# EAGLE design Work Height Sensor Base_v1p1 (EAGLE 9.3.1)
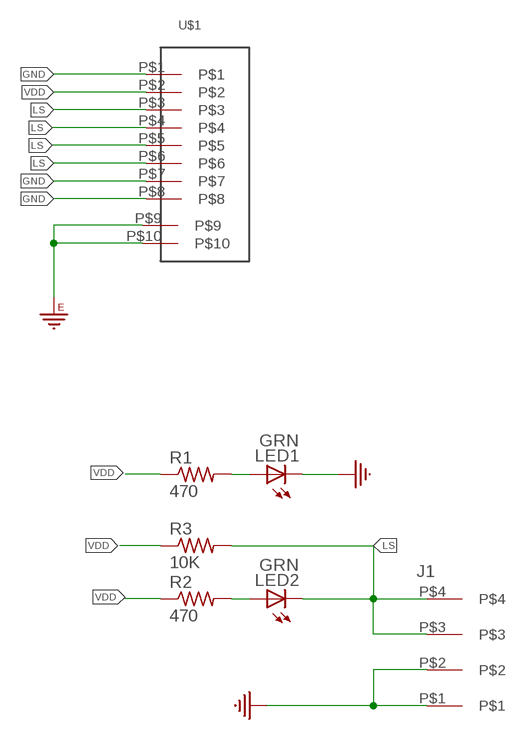
[diagram p0: schematic, sheet 1]

## Parts
J1  3.81MM_1_X_4_RT_ANGLE_PLUG_HEADER  [1X4_3.81MM_PITCH]
LED1  LED_0805_GREEN  [LED_0805_GREEN]
LED2  LED_0805_GREEN  [LED_0805_GREEN]
R1  470  R_0402  [0402]
R2  470  R_0402  [0402]
R3  10K  R_0402  [0402]
U$1  RJ45_SMTRJ  [RJ45_SMT]

## Nets
GND: J1.P$1 J1.P$2 LED1.C U$1.P$1 U$1.P$7 U$1.P$8
GNDE: U$1.P$9 U$1.P$10
LS: J1.P$3 J1.P$4 LED2.C R3.P$2 U$1.P$3 U$1.P$4 U$1.P$5 U$1.P$6
N$1: LED2.A R2.P$2
N$3: LED1.A R1.P$2
VDD: R1.P$1 R2.P$1 R3.P$1 U$1.P$2

## Library data of the parts
J1 = 3D_MIG_Controller:3.81MM_1_X_4_RT_ANGLE_PLUG_HEADER
LED1 LED2 = 3D_MIG_Controller:LED_0805_GREEN
R1-R3 = 3D_MIG_Controller:R_0402
U$1 = 3D_MIG_Controller:RJ45_SMT

## Board
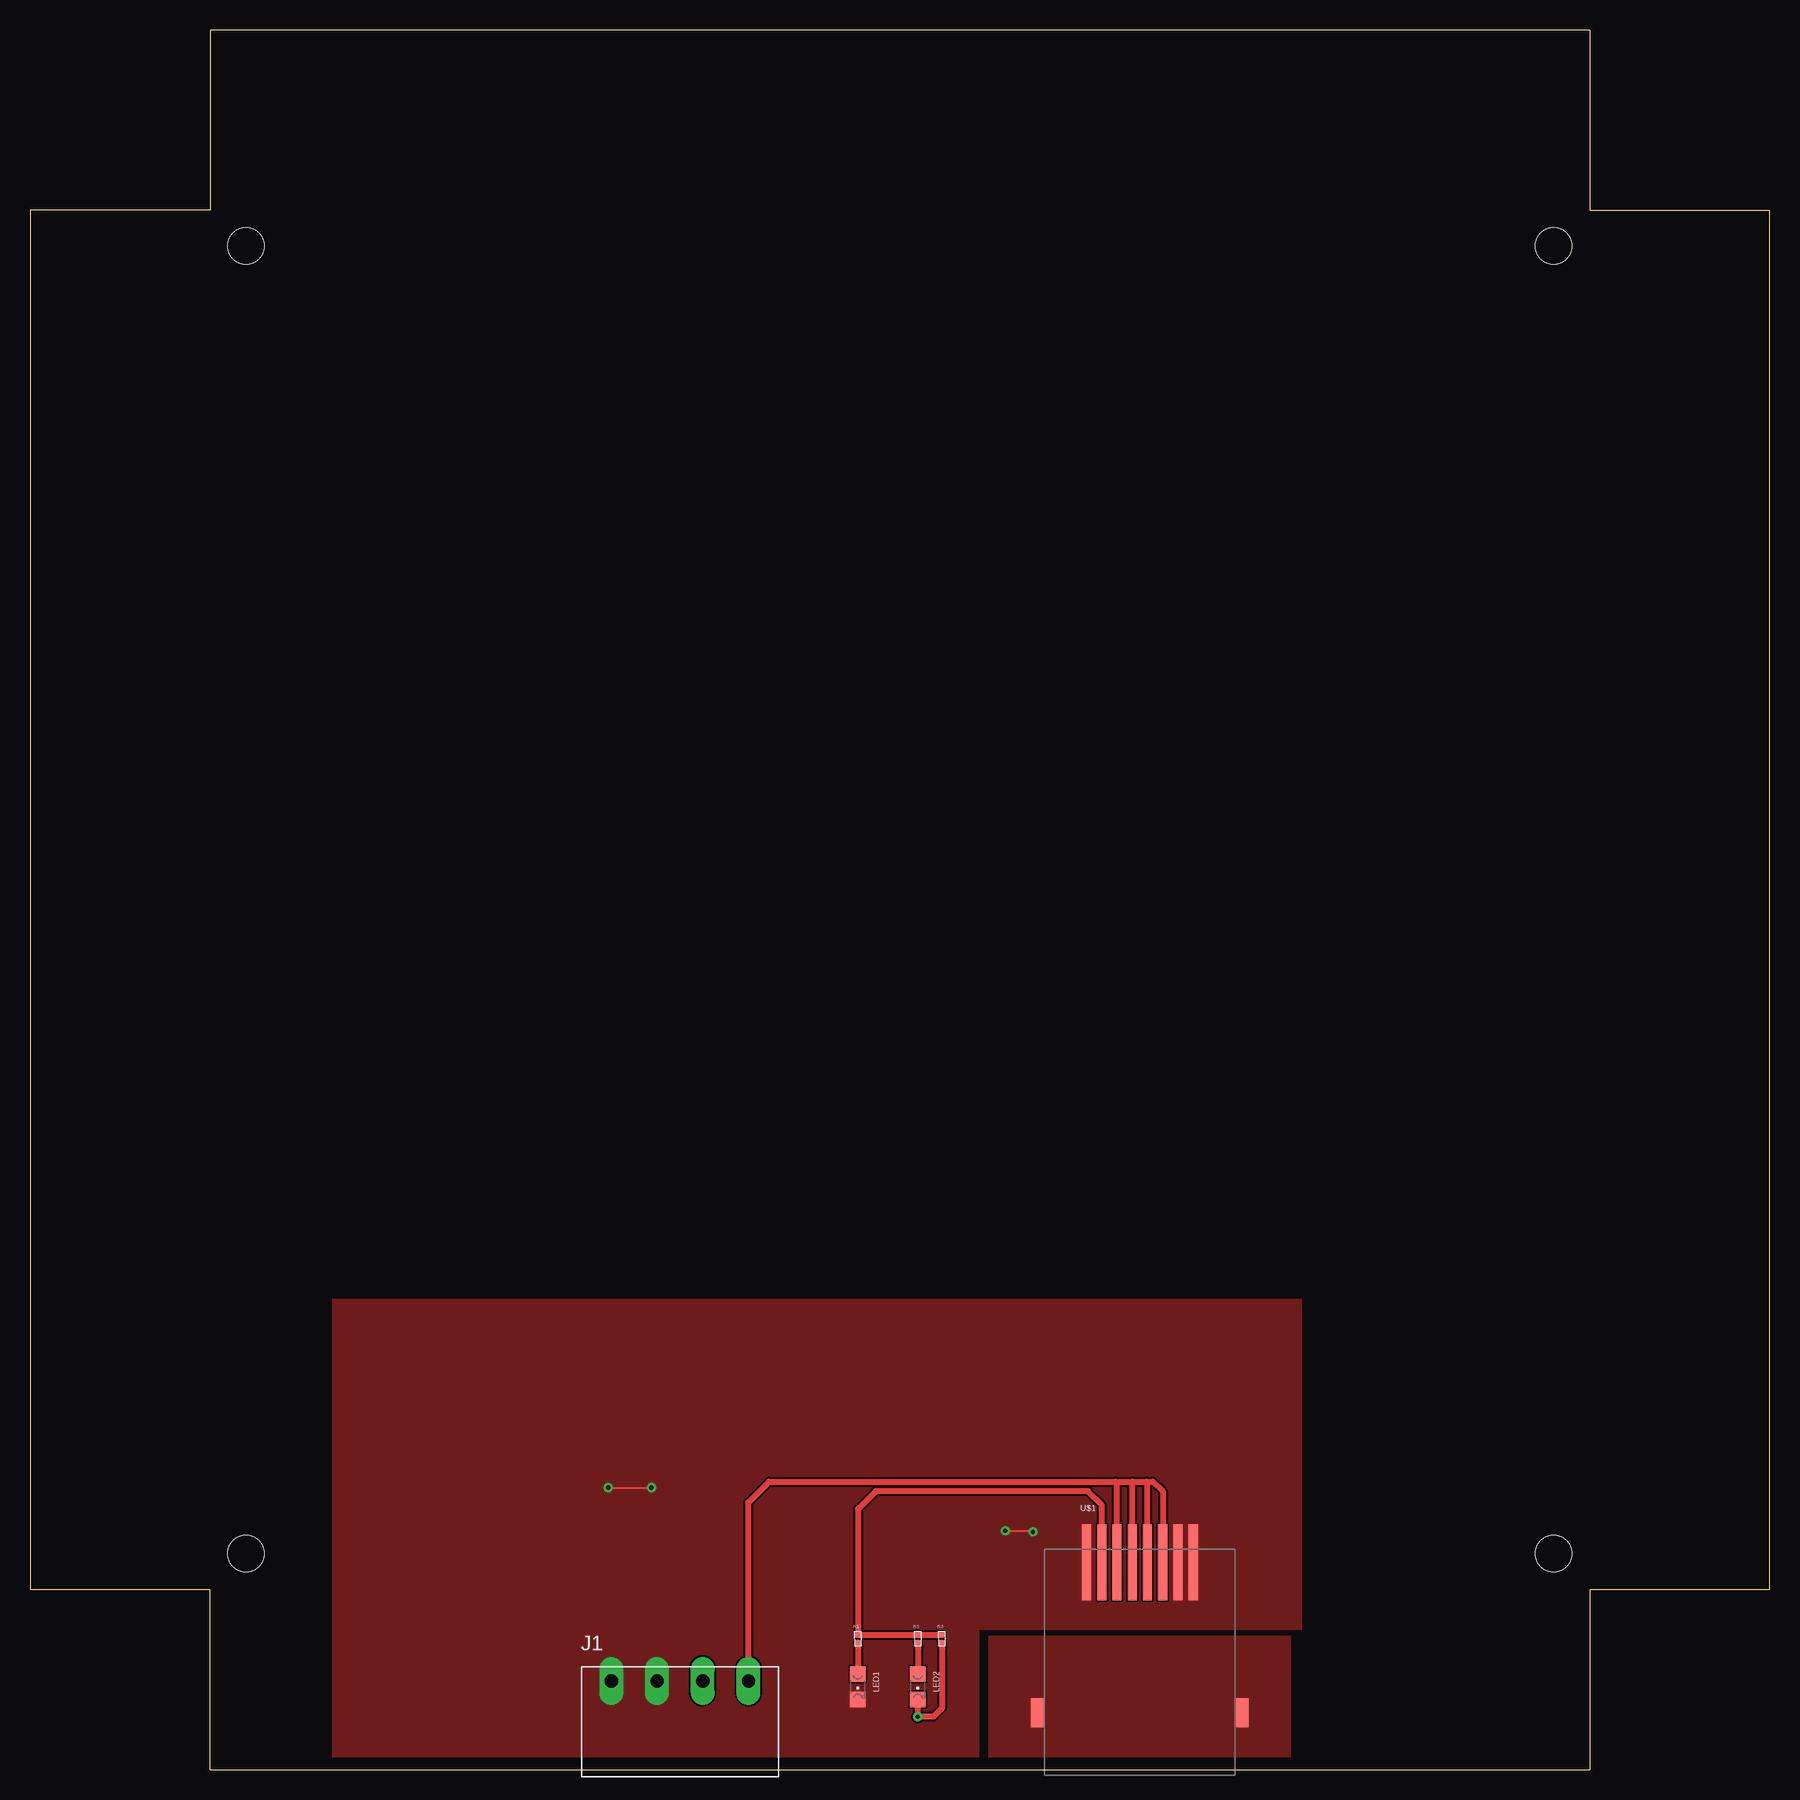
[diagram p1: board, top side]
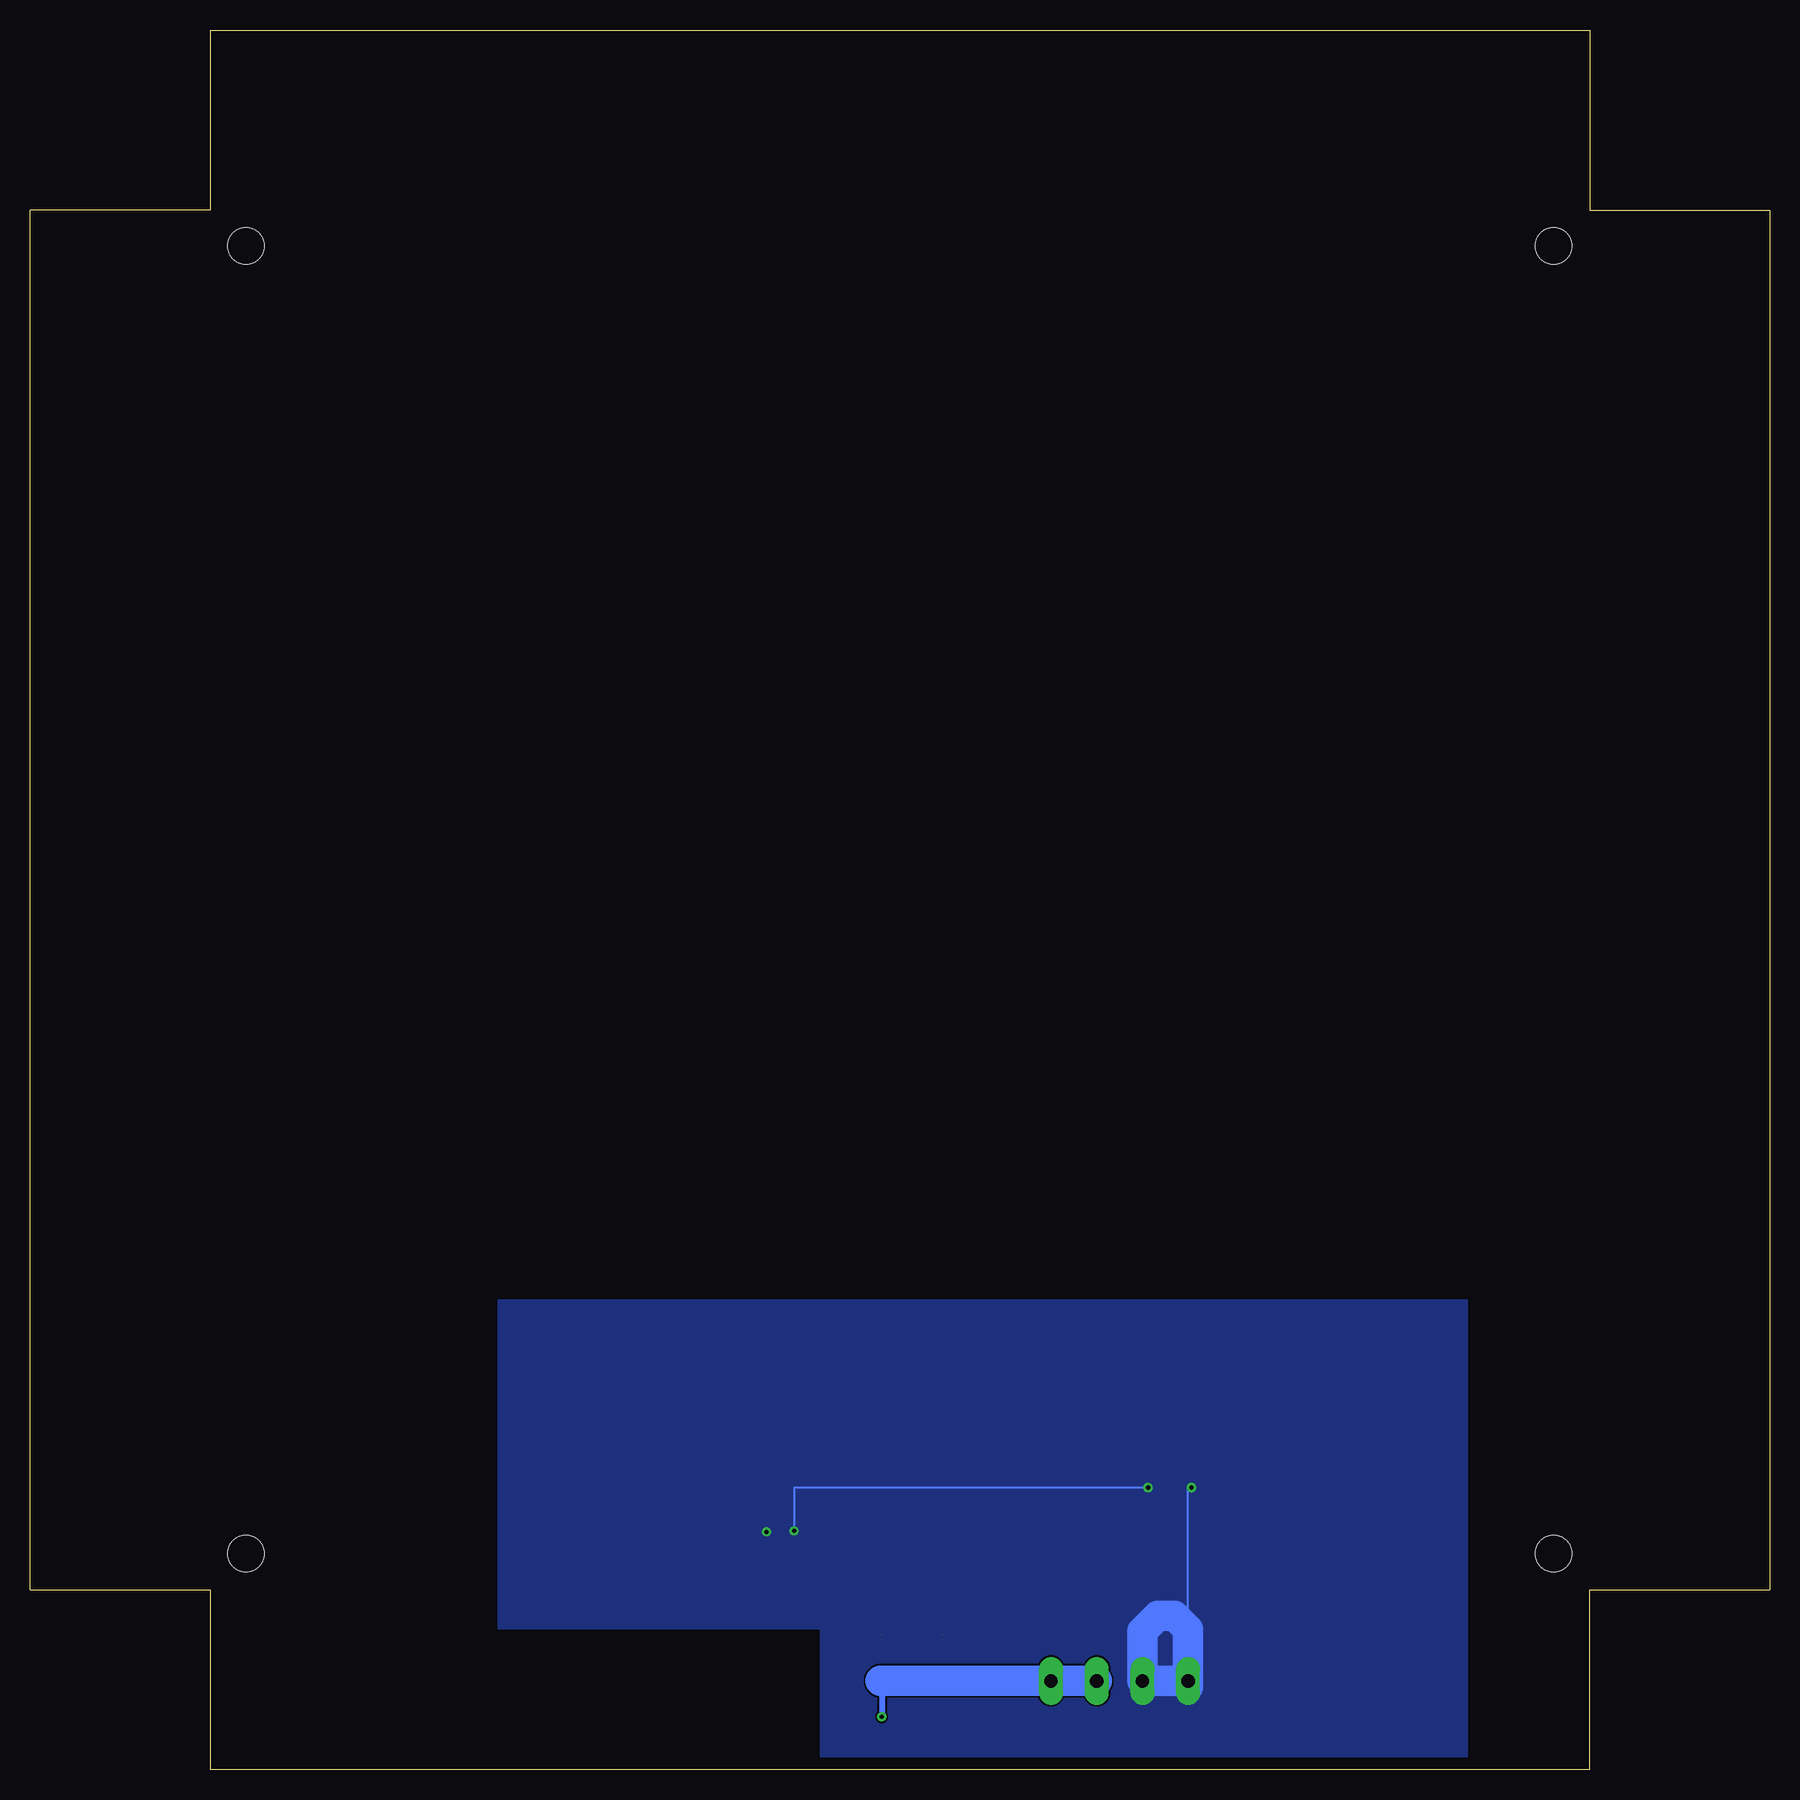
[diagram p2: board, bottom side, seen from below]

Size 145 x 145 mm. Coordinates in mm from the lower left corner, seen from the top.
Outline: 15,0 130,0 130,15 145,15 145,130 130,130 130,145 15,145 15,130 0,130 0,15 15,15 15,0
Copper layers (1*16): Top 0.035mm / dielectric 1.5mm / Bottom 0.035mm
Design rules "default": minimum track width 6mil, minimum drill 0.35mm, track to track 6mil, track to pad 6mil, pad to pad 6mil, via to via 6mil, smd to smd 6mil, copper to edge 40mil, drill to drill 6mil, minimum pad ring 10mil, minimum via ring 8mil, stop-mask expansion 4mil, vias tented up to drill 0mil, thermal gap 10mil
Holes 3 mm at 18,18 127,18 127,127 18,127

### Footprints (pad centres in the part's own frame; a part is rotated, then mirrored left to right if it is on the bottom)
1X4_3.81MM_PITCH = drill 1.1 pad 2 long: P$1 0,0; P$2 3.81,0; P$3 7.62,0; P$4 11.43,0
LED_0805_GREEN = smd 1.3 x 1.3: A 0,-1.05; C 0,1.05
0402 = smd 0.5 x 0.4: P$1 0,0.325; P$2 0,-0.325
RJ45_SMT = smd 0.76 x 6.35: P$1 -3.18,8.94; P$2 -1.91,8.94; P$3 -0.64,8.94; P$4 0.63,8.94; P$5 1.9,8.94; P$6 3.17,8.94; P$7 4.44,8.94; P$8 5.71,8.94 | smd 1.1 x 2.4: P$9 -7.25,-3.6; P$10 9.75,-3.6

### Placement (x,y rotation side)
J1  48.46,7.38 0 top
LED1  69,6.9 180 top
LED2  74,6.9 180 top
R1  69,10.9 0 top
R2  74,10.9 0 top
R3  76,10.9 0 top
U$1  91.25,8.34 0 top

### Tracks (layer width: path | path; a pad name or v marks a point on that pad's centre or on a via)
GND  (via drill 0.35)
  Top 0.152: v48.2,23.5 v51.8,23.5 | v81.3,19.9 83.6,19.9 v83.6,19.8
  Bottom 0.152: J1.P$1 48.46,23.5 v48.2,23.5 | v51.8,23.5 81.3,23.5 v81.3,19.9
  Bottom 2.54: 48.5,7.34 48.5,11.7 49.6,12.8 51,12.8 52.27,11.53 J1.P$2 J1.P$1 48.5,7.34 | 48.5,6.9 48.5,7.34
  pour Top (no thermals): 25.2,39.2 25.2,0 79.1,0 79.1,11.7 106,11.7 106,39.2
  pour Bottom (no thermals): 25.2,39.2 25.2,0 79.1,0 79.1,11.7 106,11.7 106,39.2
GNDE
  pour Top (no thermals): 79.9,11.1 79.9,0 105.1,0 105.1,11.1
LS  (via drill 0.35)
  Top 0.508: U$1.P$3 90.61,23.89 90.5,24 | LED2.C v74,4.4 75.3,4.4 76,5.1 R3.P$2 | J1.P$4 59.89,22.29 61.6,24 90.5,24 | 90.5,24 91.9,24 | 91.9,24 93.1,24 | 93.1,24 93.6,24 94.42,23.18 U$1.P$6 | U$1.P$5 93.15,23.95 93.1,24 | U$1.P$4 91.88,23.98 91.9,24
  Bottom 0.508: 74.1,7.4 74,7.3 v74,4.4
  Bottom 2.54: J1.P$3 J1.P$4 74.08,7.38 74.1,7.4
N$1
  Top 0.508: R2.P$2 LED2.A
N$3
  Top 0.508: R1.P$2 LED1.A
VDD  (2 unrouted)
  Top 0.508: U$1.P$2 89.34,22.06 88.2,23.2 70.5,23.2 69,21.7 69,11.23 74,11.23 | R2.P$1 R3.P$1